# Altium schematic sheet atWork_Power2.SchDoc
size A4
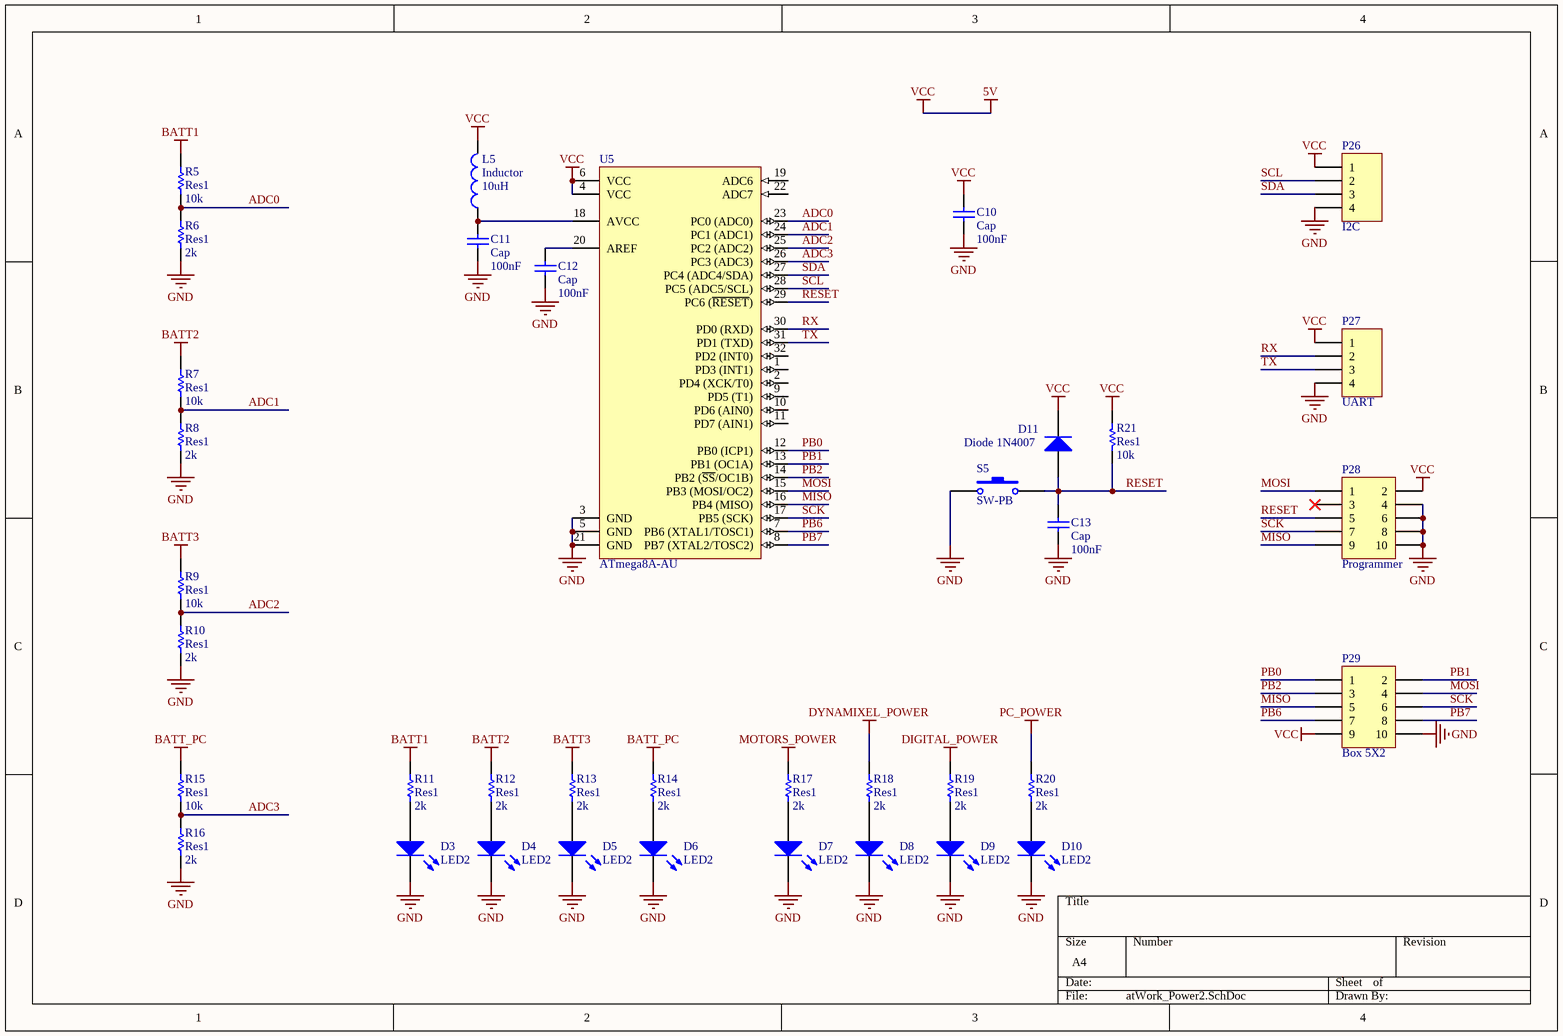
[diagram p0: atWork_Power2.SchDoc]

## Parts
C10  Cap  value 100nF  [C1206]
C11  Cap  value 100nF  [C1206]
C12  Cap  value 100nF  [C1206]
C13  Cap  value 100nF  [C1206]
D3  LED2  [3.2X1.6X1.1]
D4  LED2  [3.2X1.6X1.1]
D5  LED2  [3.2X1.6X1.1]
D6  LED2  [3.2X1.6X1.1]
D7  LED2  [3.2X1.6X1.1]
D8  LED2  [3.2X1.6X1.1]
D9  LED2  [3.2X1.6X1.1]
D10  LED2  [3.2X1.6X1.1]
D11  Diode 1N4007  [DIODE-SMD]
L5  Inductor  value 10uH  [C1206]
P26  I2C  [XH4PIN]
P27  UART  [XH4PIN]
P28  Programmer  [BOX2X5]
P29  Box 5X2  [BOX2X5]
R5  Res1  value 10k  [C1206]
R6  Res1  value 2k  [C1206]
R7  Res1  value 10k  [C1206]
R8  Res1  value 2k  [C1206]
R9  Res1  value 10k  [C1206]
R10  Res1  value 2k  [C1206]
R11  Res1  value 2k  [C1206]
R12  Res1  value 2k  [C1206]
R13  Res1  value 2k  [C1206]
R14  Res1  value 2k  [C1206]
R15  Res1  value 10k  [C1206]
R16  Res1  value 2k  [C1206]
R17  Res1  value 2k  [C1206]
R18  Res1  value 2k  [C1206]
R19  Res1  value 2k  [C1206]
R20  Res1  value 2k  [C1206]
R21  Res1  value 10k  [C1206]
S5  SW-PB  [PUSH1]
U5  ATmega8A-AU  [32A_M]

## Nets
5V: C10.2 D11.2(K) L5.2 P26.1 P27.1 P28.2 P29.9 R21.1 U5.4(VCC) U5.6(VCC)  [also labelled VCC]
BATT1: R5.1 R11.2
BATT2: R7.1 R12.2
BATT3: R9.1 R13.2
BATT_PC: R14.2 R15.1
DIGITAL_POWER: R19.2
DYNAMIXEL_POWER: R18.2
GND: C10.1 C11.1 C12.1 C13.1 D3.2(K) D4.2(K) D5.2(K) D6.2(K) D7.2(K) D8.2(K) D9.2(K) D10.2(K) P26.4 P27.4 P28.4 P28.6 P28.8 P28.10 P29.10 R6.2 R8.2 R10.2 R16.2 S5.2 U5.3(GND) U5.5(GND) U5.21(GND)
MOTORS_POWER: R17.2
PC_POWER: R20.2
ADC0: R5.2 R6.1 U5.23(PC0_(ADC0))
ADC1: R7.2 R8.1 U5.24(PC1_(ADC1))
ADC2: R9.2 R10.1 U5.25(PC2_(ADC2))
ADC3: R15.2 R16.1 U5.26(PC3_(ADC3))
MISO: P28.9 P29.5 U5.16(PB4_(MISO))
MOSI: P28.1 P29.4 U5.15(PB3_(MOSI/OC2))
PB0: P29.1 U5.12(PB0_(ICP1))
PB1: P29.2 U5.13(PB1_(OC1A))
PB2: P29.3 U5.14(PB2_(~{SS}/OC1B))
PB6: P29.7 U5.7(PB6_(XTAL1/TOSC1))
PB7: P29.8 U5.8(PB7_(XTAL2/TOSC2))
RESET: C13.2 D11.1(A) P28.5 R21.2 S5.1 U5.29(PC6_(~{RESET}))
RX: P27.2 U5.30(PD0_(RXD))
SCK: P28.7 P29.6 U5.17(PB5_(SCK))
SCL: P26.2 U5.28(PC5_(ADC5/SCL))
SDA: P26.3 U5.27(PC4_(ADC4/SDA))
TX: P27.3 U5.31(PD1_(TXD))
NetC11_2: C11.2 L5.1 U5.18(AVCC)
NetC12_2: C12.2 U5.20(AREF)
NetD3_1: D3.1(A) R11.1
NetD4_1: D4.1(A) R12.1
NetD5_1: D5.1(A) R13.1
NetD6_1: D6.1(A) R14.1
NetD7_1: D7.1(A) R17.1
NetD8_1: D8.1(A) R18.1
NetD9_1: D9.1(A) R19.1
NetD10_1: D10.1(A) R20.1

Not connected (* = marked no-connect by the designer): P28 3*; U5 1(PD3_(INT1)) 2(PD4_(XCK/T0)) 9(PD5_(T1)) 10(PD6_(AIN0)) 11(PD7_(AIN1)) 19(ADC6) 22(ADC7) 32(PD2_(INT0))

## Library data of the parts
C10-C13 = Cap: Capacitor; Published: 8-Jun-2000; LatestRevisionDate: 17-Jul-2002; LatestRevisionNote: Re-released for DXP Platform.; PackageReference: RAD-0.3; Publisher: Altium Limited; PackageDescription: Radial Cap, Thru-Hole; 2 Leads; 0.3 in Pin Spacing
D3-D10 = LED2: Typical RED, GREEN, YELLOW, AMBER GaAs LED; Published: 8-Jun-2000; LatestRevisionDate: 17-Jul-2002; LatestRevisionNote: Re-released for DXP Platform.; PackageVersion: Feb-2002; PackageReference: 3.2X1.6X1.1; Publisher: Altium Limited; PackageDescription: SM LED; 2 Flat Leads
D11 = Diode 1N4007: 1 Amp General Purpose Rectifier; Published: 8-Jun-2000; LatestRevisionDate: 17-Jul-2002; LatestRevisionNote: Re-released for DXP Platform.; DatasheetVersion: 1998; PackageVersion: Aug-1999; PackageReference: DO-41; Publisher: Altium Limited; PackageDescription: Diode, Axial; Body 5.2 x 2.7 mm (LxDia. max), Lead Dia. 0.86 mm (max); Code_JEDEC: DO-204-AL; ComponentLink1Description: Manufacturer Link; ComponentLink1URL: http://www.fairchildsemi.com/; ComponentLink2Description: Datasheet; ComponentLink2URL: http://www.fairchildsemi.com/ds/1N%2F1N4001.pdf
L5 = Inductor: Code_IEC: 1005; Published: 8-Jun-2000; LatestRevisionDate: 29-May-2009; LatestRevisionNote: IPC-7351 Footprint Added.; PackageReference: 0402-A; Publisher: Altium Limited; PackageDescription: Chip Inductor; Code_JEITA: 0402
P26 P27 = Header 4: Header, 4-Pin; LatestRevisionDate: 17-Jul-2002; LatestRevisionNote: Re-released for DXP Platform.; Publisher: Altium Limited
P28 P29 = Box 5X2: Box, 5-Pin, Dual row; Designer: Meysam Parvizi; Email: meysam.parvizi.ir@gmail.com; Weblog: http://mp.tabin.ir
R5-R21 = Res1: Resistor; Published: 8-Jun-2000; LatestRevisionDate: 17-Jul-2002; LatestRevisionNote: Re-released for DXP Platform.; PackageReference: AXIAL-0.3; Publisher: Altium Limited; PackageDescription: Axial Device, Thru-Hole; 2 Leads; 0.3 in Pin Spacing
S5 = SW-PB: Switch; Published: 24-Mar-1999; LatestRevisionDate: 17-Jul-2002; LatestRevisionNote: Re-released for DXP Platform.; PackageReference: SPST-2; Publisher: Altium Limited; PackageDescription: Switch; 2 Leads
U5 = ATmega8A-AU: 8-bit AVR Microcontroller, 8KB Flash, 512 Bytes EEPROM, 1KB SRAM, 32-pin TQFP, Industrial Grade (-40°C to 85°C); Published: 1-Apr-2010; DatasheetVersion: revC, Jul-2009; PackageVersion: revB, Oct-2001; PackageReference: 32A; Publisher: Altium Limited; PackageDescription: 32-Lead, 7x7x1.0 mm Body, 0.8mm Lead Pitch, Thin Profile Plastic Quad Flat Package (TQFP); Supplier 1: Digi-Key; Supplier Part Number 1: ATMEGA8A-AU-ND; Supplier 2: Farnell; Supplier Part Number 2: 1748532; Supplier 3: Mouser; Supplier Part Number 3: 556-ATMEGA8A-AU; Code_JEDEC: MS-026-ABA; ComponentLink1Description: Manufacturer Link; ComponentLink1URL: http://www.atmel.com/products/avr/default.asp?; ComponentLink2Description: ATmega8A Datasheet; ComponentLink2URL: http://www.atmel.com/dyn/resources/prod_documents/doc8159.pdf; ComponentLink3Description: ATmega8A Summary; ComponentLink3URL: http://www.atmel.com/dyn/resources/prod_documents/8159S.pdf; ComponentLink4Description: Atmel.com Home; ComponentLink4URL: http://www.atmel.com